# EAGLE design cherrymx_rgb_8row_breakout (EAGLE 9.6.0)
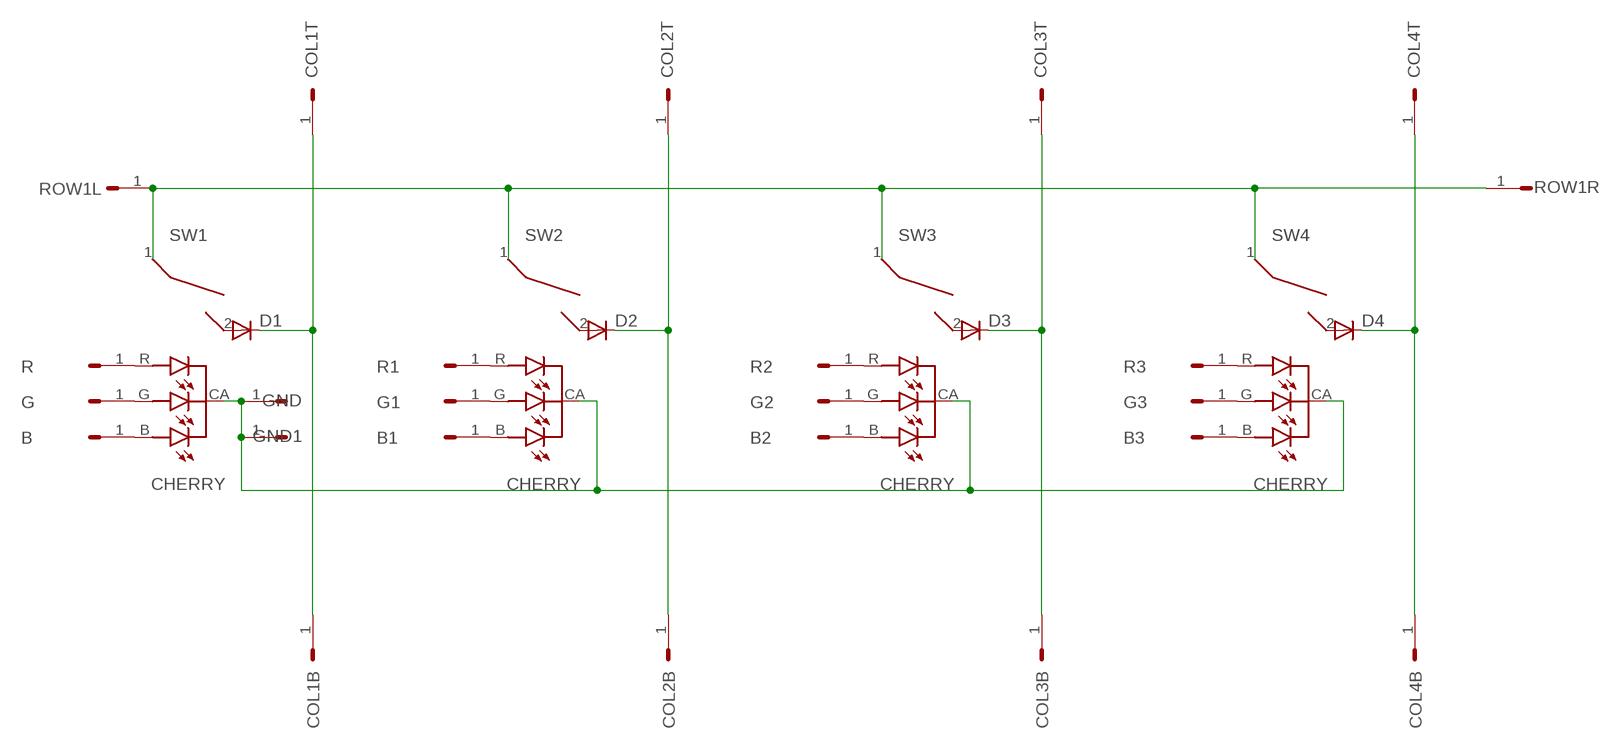
[diagram p0: schematic, sheet 1]

## Parts
B  HEADER/MALE/01  [HEADER/MALE/01]
B1  HEADER/MALE/01  [HEADER/MALE/01]
B2  HEADER/MALE/01  [HEADER/MALE/01]
B3  HEADER/MALE/01  [HEADER/MALE/01]
COL1B  HEADER/MALE/01  [HEADER/MALE/01]
COL1T  HEADER/MALE/01  [HEADER/MALE/01]
COL2B  HEADER/MALE/01  [HEADER/MALE/01]
COL2T  HEADER/MALE/01  [HEADER/MALE/01]
COL3B  HEADER/MALE/01  [HEADER/MALE/01]
COL3T  HEADER/MALE/01  [HEADER/MALE/01]
COL4B  HEADER/MALE/01  [HEADER/MALE/01]
COL4T  HEADER/MALE/01  [HEADER/MALE/01]
D1  1N4148DO35-7  [DO35-7]
D2  1N4148DO35-7  [DO35-7]
D3  1N4148DO35-7  [DO35-7]
D4  1N4148DO35-7  [DO35-7]
G  HEADER/MALE/01  [HEADER/MALE/01]
G1  HEADER/MALE/01  [HEADER/MALE/01]
G2  HEADER/MALE/01  [HEADER/MALE/01]
G3  HEADER/MALE/01  [HEADER/MALE/01]
GND  HEADER/MALE/01  [HEADER/MALE/01]
GND1  HEADER/MALE/01  [HEADER/MALE/01]
R  HEADER/MALE/01  [HEADER/MALE/01]
R1  HEADER/MALE/01  [HEADER/MALE/01]
R2  HEADER/MALE/01  [HEADER/MALE/01]
R3  HEADER/MALE/01  [HEADER/MALE/01]
ROW1L  HEADER/MALE/01  [HEADER/MALE/01]
ROW1R  HEADER/MALE/01  [HEADER/MALE/01]
SW1  CHERRY  SWITCH_CHERRY_MX_RGBSWITCH_CHERRY_MX_RGB  [SWITCH_CHERRY_MX_RGB]
SW2  CHERRY  SWITCH_CHERRY_MX_RGBSWITCH_CHERRY_MX_RGB  [SWITCH_CHERRY_MX_RGB]
SW3  CHERRY  SWITCH_CHERRY_MX_RGBSWITCH_CHERRY_MX_RGB  [SWITCH_CHERRY_MX_RGB]
SW4  CHERRY  SWITCH_CHERRY_MX_RGBSWITCH_CHERRY_MX_RGB  [SWITCH_CHERRY_MX_RGB]

## Nets
N$2: D1.A SW1.2
N$3: B.1 SW1.B(B-CAT)
N$4: G.1 SW1.G(G-CAT)
N$5: R.1 SW1.R(R-CAT)
N$7: COL1B.1 COL1T.1 D1.C
N$8: GND1.1 GND.1 SW1.CA(COMMON-ANODE) SW2.CA(COMMON-ANODE) SW3.CA(COMMON-ANODE) SW4.CA(COMMON-ANODE)
N$9: B1.1 SW2.B(B-CAT)
N$10: G1.1 SW2.G(G-CAT)
N$11: R1.1 SW2.R(R-CAT)
N$13: D2.A SW2.2
N$14: COL2B.1 COL2T.1 D2.C
N$15: B2.1 SW3.B(B-CAT)
N$16: G2.1 SW3.G(G-CAT)
N$17: R2.1 SW3.R(R-CAT)
N$19: D3.A SW3.2
N$20: COL3B.1 COL3T.1 D3.C
N$22: B3.1 SW4.B(B-CAT)
N$23: G3.1 SW4.G(G-CAT)
N$24: R3.1 SW4.R(R-CAT)
N$26: D4.A SW4.2
N$27: COL4B.1 COL4T.1 D4.C
N$49: ROW1L.1 ROW1R.1 SW1.1 SW2.1 SW3.1 SW4.1

## Library data of the parts
B B2 B3 COL1B COL1T COL3B COL3T COL4B COL4T G G2 G3 GND GND1 R R2 R3 ROW1L ROW1R = connectors:HEADER/MALE/01
B1 COL2B COL2T G1 R1 = connectors:HEADER/MALE/01; SPICEPREFIX: X
D1 D3 D4 = transistors:1N4148: DIODE high speed (Philips)
D2 = transistors:1N4148: DIODE high speed (Philips); SPICEPREFIX: D
SW1 SW3 SW4 = controls:SWITCH_CHERRY_MX_RGB
SW2 = controls:SWITCH_CHERRY_MX_RGB; SPICEPREFIX: X

## Board
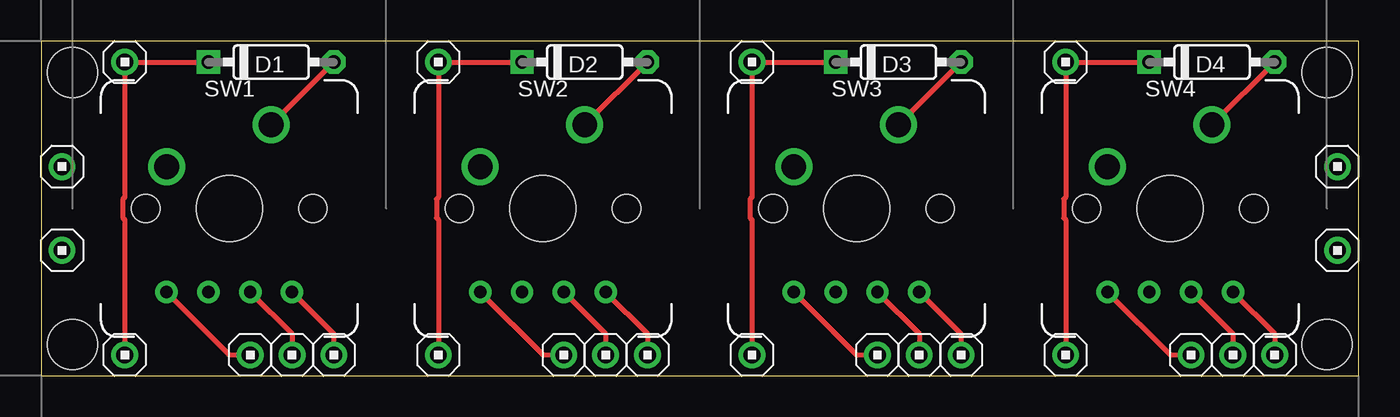
[diagram p1: board, top side]
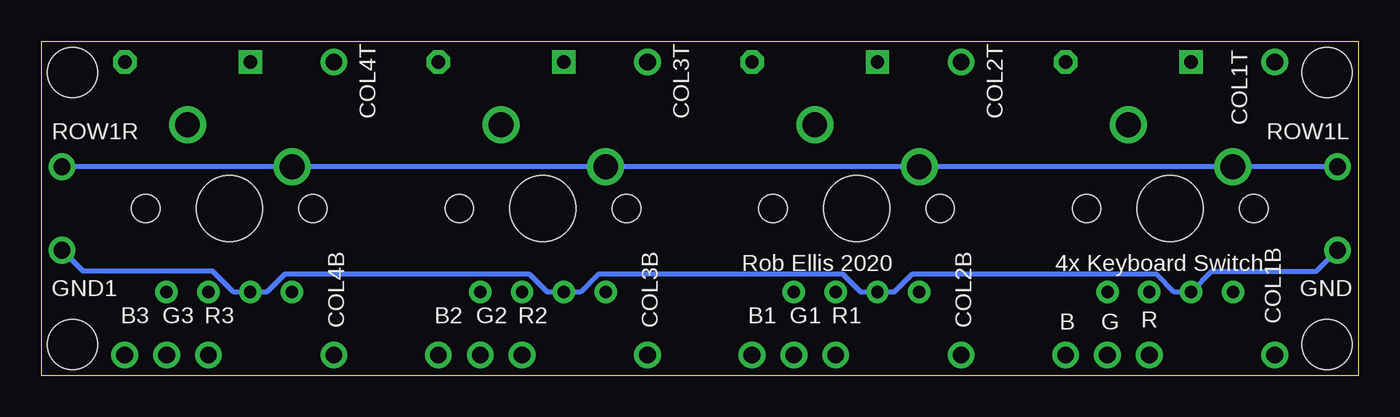
[diagram p2: board, bottom side, seen from below]

Size 80.01 x 20.32 mm. Coordinates in mm from the lower left corner, seen from the top.
Outline: 0,0 80.01,0 80.01,20.32 0.01,20.32 0,20.31 0,0
Copper layers (1*16): Top 0.0356mm / dielectric 1.5011mm / Bottom 0.0356mm
Design rules "pigatron": minimum track width 12mil, minimum drill 13mil, track to track 15mil, track to pad 10mil, pad to pad 10mil, via to via 10mil, smd to smd 6mil, copper to edge 15mil, drill to drill 10mil, minimum pad ring 12mil, minimum via ring 10mil, stop-mask expansion 4mil, vias tented up to drill 0mil, thermal gap 10mil
Holes 3.05 mm at 1.91,1.9 1.91,18.41 78.11,18.41 78.11,1.9

### Footprints (pad centres in the part's own frame; a part is rotated, then mirrored left to right if it is on the bottom)
HEADER/MALE/01 = drill 1.016: 1 0,0
DO35-7 = drill 0.813 octagon: A 3.81,0 | drill 0.813 square: C -3.81,0
SWITCH_CHERRY_MX_RGB = drill 1.5: 1 -3.81,2.54; 2 2.54,5.08 | drill 0.75: B 3.81,-5.08; CA -1.27,-5.08; G 1.27,-5.08; R -3.81,-5.08 | hole 4: 0,0 | hole 1.7: -5.08,0; 5.08,0

### Placement (x,y rotation side)
B  17.78,1.27 90 top
B1  36.83,1.27 90 top
B2  55.88,1.27 90 top
B3  74.93,1.27 90 top
COL1B  5.08,1.27 90 top
COL1T  5.08,19.05 270 top
COL2B  24.13,1.27 0 top
COL2T  24.13,19.05 0 top
COL3B  43.18,1.27 0 top
COL3T  43.18,19.05 0 top
COL4B  62.23,1.27 0 top
COL4T  62.23,19.05 0 top
D1  13.97,19.05 0 top
D2  33.02,19.05 0 top
D3  52.07,19.05 0 top
D4  71.12,19.05 0 top
G  15.24,1.27 90 top
G1  34.29,1.27 90 top
G2  53.34,1.27 90 top
G3  72.39,1.27 90 top
GND  1.27,7.62 90 top
GND1  78.74,7.62 0 top
R  12.7,1.27 90 top
R1  31.75,1.27 90 top
R2  50.8,1.27 90 top
R3  69.85,1.27 90 top
ROW1L  1.27,12.7 0 top
ROW1R  78.74,12.7 0 top
SW1  11.43,10.16 0 top
SW2  30.48,10.16 0 top
SW3  49.53,10.16 0 top
SW4  68.58,10.16 0 top

### Tracks (layer width: path | path; a pad name or v marks a point on that pad's centre or on a via)
N$2
  Top 0.305: D1.A SW1.2
N$3
  Top 0.305: SW1.B 17.78,2.54 B.1
N$4
  Top 0.305: SW1.G 15.24,2.54 G.1
N$5
  Top 0.305: SW1.R 11.43,1.27 R.1
N$7
  Top 0.305: COL1B.1 5.08,9.47 4.97,9.59 4.97,10.73 5.08,10.85 COL1T.1 D1.C
N$8
  Bottom 0.305: GND.1 2.54,6.35 8.89,6.35 SW1.CA 11.16,5.08 12.25,6.17 27.12,6.17 28.21,5.08 SW2.CA 30.21,5.08 31.3,6.17 46.17,6.17 47.26,5.08 SW3.CA 49.26,5.08 50.35,6.17 65.22,6.17 66.31,5.08 SW4.CA 68.31,5.08 69.58,6.35 77.47,6.35 GND1.1
N$9
  Top 0.305: SW2.B 36.83,2.54 B1.1
N$10
  Top 0.305: SW2.G 34.29,2.54 G1.1
N$11
  Top 0.305: SW2.R 30.48,1.27 R1.1
N$13
  Top 0.305: D2.A SW2.2
N$14
  Top 0.305: COL2B.1 24.13,9.47 24.02,9.59 24.02,10.73 24.13,10.85 COL2T.1 D2.C
N$15
  Top 0.305: SW3.B 55.88,2.54 B2.1
N$16
  Top 0.305: SW3.G 53.34,2.54 G2.1
N$17
  Top 0.305: SW3.R 49.53,1.27 R2.1
N$19
  Top 0.305: D3.A SW3.2
N$20
  Top 0.305: COL3B.1 43.18,9.47 43.07,9.59 43.07,10.73 43.18,10.85 COL3T.1 D3.C
N$22
  Top 0.305: SW4.B 74.93,2.54 B3.1
N$23
  Top 0.305: SW4.G 72.39,2.54 G3.1
N$24
  Top 0.305: SW4.R 68.58,1.27 R3.1
N$26
  Top 0.305: D4.A SW4.2
N$27
  Top 0.305: COL4B.1 62.23,9.47 62.12,9.59 62.12,10.73 62.23,10.85 COL4T.1 D4.C
N$49
  Bottom 0.305: ROW1L.1 SW1.1 SW2.1 SW3.1 SW4.1 ROW1R.1

### Text on the board
bNames: 4x Keyboard Switch | Rob Ellis 2020